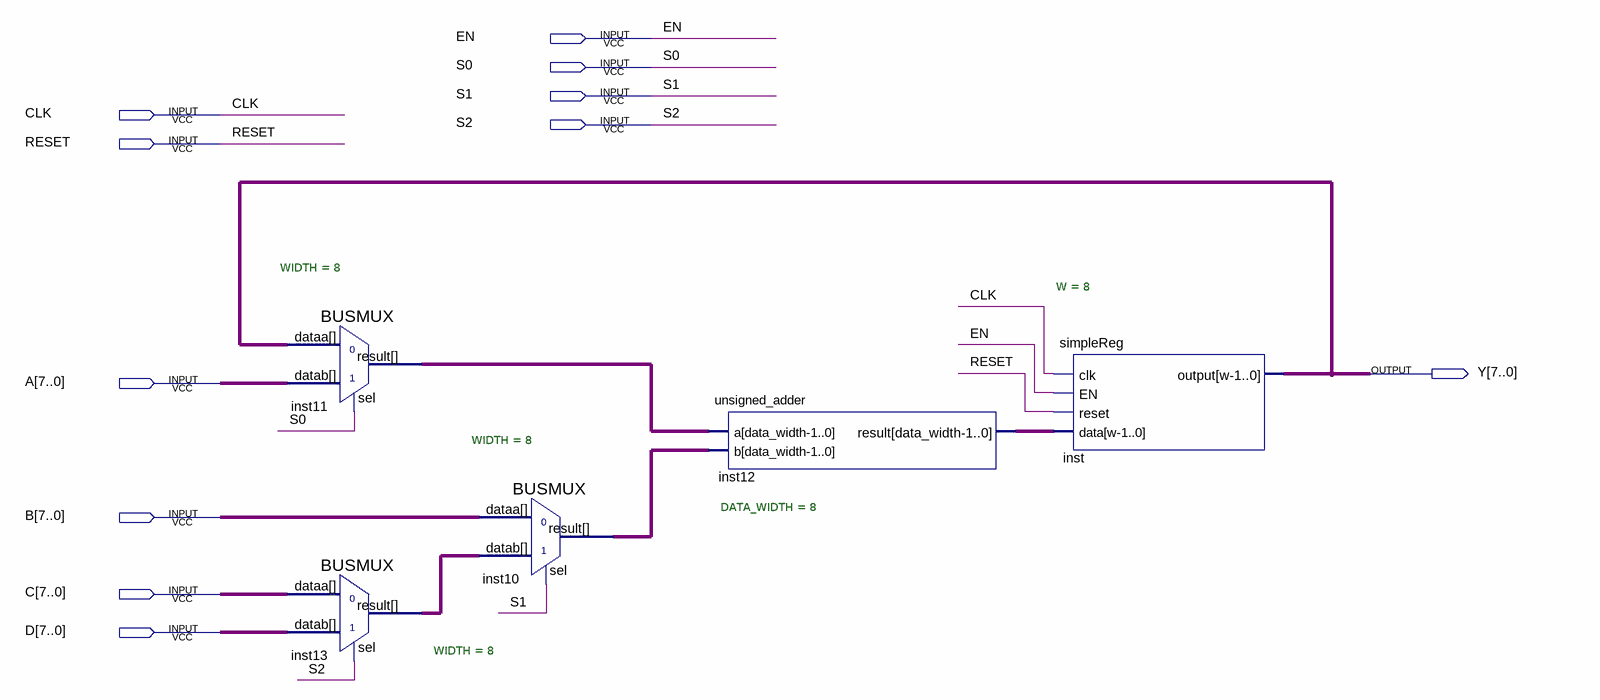
[diagram p0: schematic sheet]
// Quartus schematic add_rtl.bdf as structural Verilog: 5 symbols, 11 pins
module add_rtl (
  input  EN,
  input  S0,
  input  S1,
  input  CLK,
  input  S2,
  input  RESET,
  input  [7:0] A,
  input  [7:0] B,
  input  [7:0] C,
  input  [7:0] D,
  output [7:0] Y
);

  wire [7:0] inst10_result, inst11_result, inst12_result, inst13_result;

  BUSMUX #(.WIDTH(8)) inst11 (.datab(A), .sel(S0), .dataa(Y), .result(inst11_result));
  BUSMUX #(.WIDTH(8)) inst13 (.datab(D), .sel(S2), .dataa(C), .result(inst13_result));
  BUSMUX #(.WIDTH(8)) inst10 (.datab(inst13_result), .sel(S1), .dataa(B), .result(inst10_result));
  unsigned_adder #(.DATA_WIDTH(8)) inst12 (.a(inst11_result), .b(inst10_result), .result(inst12_result));
  simpleReg #(.W(8)) inst (.clk(CLK), .EN(EN), .reset(RESET), .data(inst12_result), .\output (Y));
endmodule
